# Altium schematic sheet E_Board_AVR.SchDoc
size A
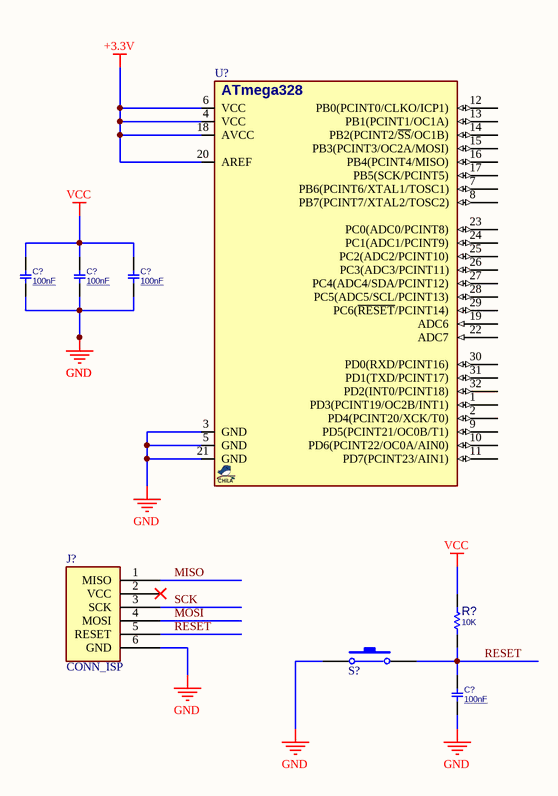
[diagram p0: E_Board_AVR.SchDoc]

## Parts
(Parts that share a designator on the sheet are numbered #1, #2 ... from top to bottom, then left to right.)
C?#1  100nF  [C0805]
C?#2  100nF  [C0805]
C?#3  100nF  [C0805]
C?#4  100nF  [C0805]
J?  CONN_ISP  [IDC_2X3]
R?  10K  [R0805]
S?  Push Button 2Pin  [Push Button SMD 2Pin KFC]  (value not drawn)
U?  ATMEGA328  [QFG80_32]  (value not drawn)

## Nets
+3.3V: U?.4(VCC) U?.6(VCC) U?.18(AVCC) U?.20(AREF)
GND: C?#1.1 C?#2.1 C?#3.1 C?#4.1 J?.6(GND) S?.1 U?.3(GND) U?.5(GND) U?.21(GND)
VCC: C?#1.2 C?#2.2 C?#3.2 R?.2
MISO: J?.1(MISO)
MOSI: J?.4(MOSI)
RESET: C?#4.2 J?.5(RESET) R?.1 S?.2
SCK: J?.3(SCK)

Not connected (* = marked no-connect by the designer): J? 2(VCC)*; U? 1(PD3(PCINT19/OC2B/INT1)) 2(PD4(PCINT20/XCK/T0)) 7(PB6(PCINT6/XTAL1/TOSC1)) 8(PB7(PCINT7/XTAL2/TOSC2)) 9(PD5(PCINT21/OC0B/T1)) 10(PD6(PCINT22/OC0A/AIN0)) 11(PD7(PCINT23/AIN1)) 12(PB0(PCINT0/CLKO/ICP1)) 13(PB1(PCINT1/OC1A)) 14(PB2(PCINT2/~{SS}/OC1B)) 15(PB3(PCINT3/OC2A/MOSI)) 16(PB4(PCINT4/MISO)) 17(PB5(SCK/PCINT5)) 19(ADC6) 22(ADC7) 23(PC0(ADC0/PCINT8)) 24(PC1(ADC1/PCINT9)) 25(PC2(ADC2/PCINT10)) 26(PC3(ADC3/PCINT11)) 27(PC4(ADC4/SDA/PCINT12)) 28(PC5(ADC5/SCL/PCINT13)) 29(PC6(~{RESET}/PCINT14)) 30(PD0(RXD/PCINT16)) 31(PD1(TXD/PCINT17)) 32(PD2(INT0/PCINT18))

## Notes on the sheet
- (in symbol ATMEGA328_QFP32) ATmega328

## Library data of the parts
C?#1-C?#4 = CAP_SMD_MLCC_0805: CAP, MLCC, -F, -V, MATERIAL, -%, 0201; PARAM: -, -%; MANF_P#: MANF_PART#; PRICE: 100= 1$; PARAM2: -V; ASSEMBLY: ASSEMBLY; VALUE: 100nF
J? = CONN_AVR_ISP_IDC6: CONN, ISP, AVR , HEADER BOX; VALUE: CONN_ISP
R? = RES_SMD_0805: RESISTOR, SMD; PARAM: -W; DESC: DESCRIPTION; DIST#: MOUSER; PARAM2: 1%; MANF_P#: -; MANF: -; ASSEMBLY: ASSEMBLY; PRICE: 100= 0.5$; VALUE: 10K
S? = Push Button: Library Link: https://github.com/Majid-Derhambakhsh; Publisher: Majid Derhambakhsh
U? = ATMEGA328_QFP32: MCU, AVR, 8-Bit, 16KB, 1KB RAM, 20MHz; PART#ALT: ATmega8-48-88-168-328; MANF_P#: ATMEGA328-AU; DESC: 1KB EEPROM; MANF: ATMEL/MICROCHIP; PARAM2: 1.8~5.5V; PARAM: 32KB, 2KB RAM, 20MHz, -40~85°C; PRICE: 2.2$; VALUE: ATMEGA328